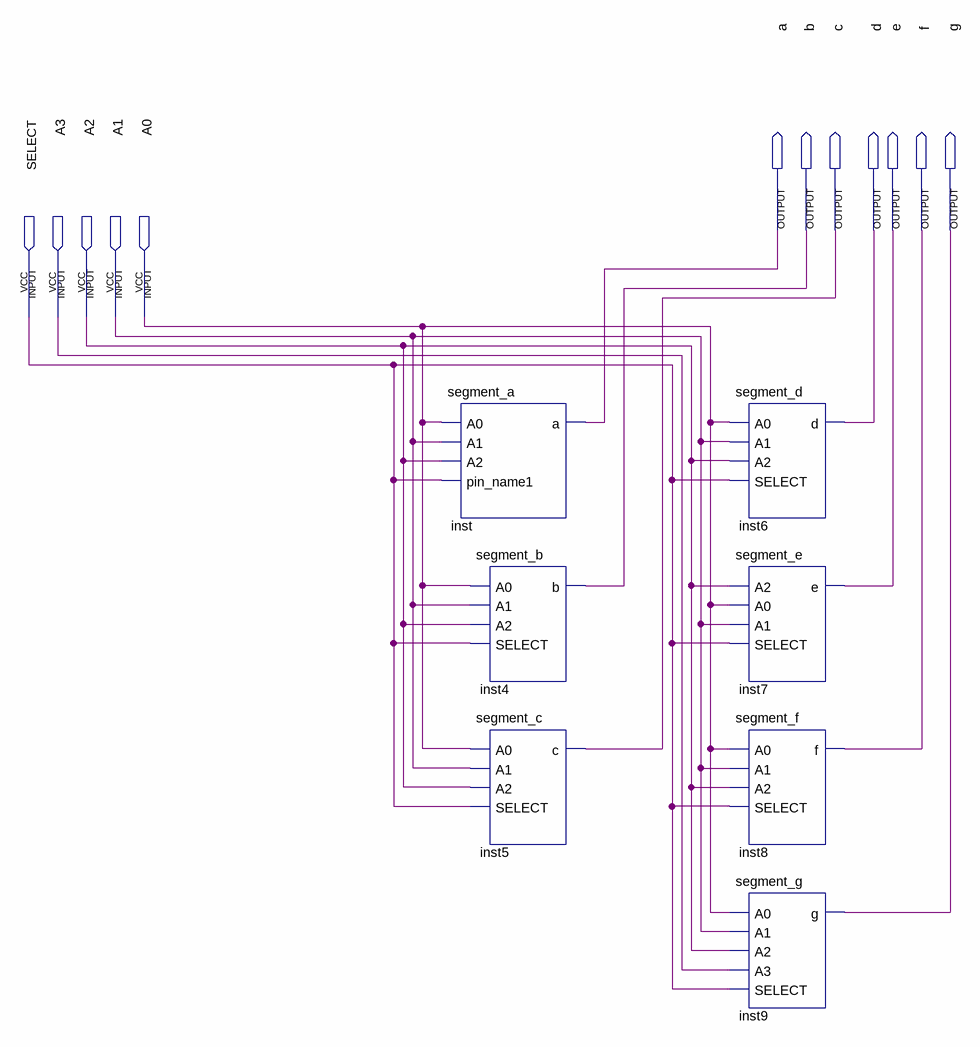
[diagram p0: schematic sheet]
// Quartus schematic segment_display_decoder.bdf as structural Verilog: 7 symbols, 12 pins
module segment_display_decoder (
  input  SELECT,
  input  A3,
  input  A2,
  input  A1,
  input  A0,
  output a,
  output b,
  output c,
  output d,
  output e,
  output f,
  output g
);

  segment_a inst (.A0(A0), .A1(A1), .A2(A2), .pin_name1(SELECT), .a(a));
  segment_b inst4 (.A0(A0), .A1(A1), .A2(A2), .SELECT(SELECT), .b(b));
  segment_c inst5 (.A0(A0), .A1(A1), .A2(A2), .SELECT(SELECT), .c(c));
  segment_d inst6 (.A0(A0), .A1(A1), .A2(A2), .SELECT(SELECT), .d(d));
  segment_e inst7 (.A2(A2), .A0(A0), .A1(A1), .SELECT(SELECT), .e(e));
  segment_f inst8 (.A0(A0), .A1(A1), .A2(A2), .SELECT(SELECT), .f(f));
  segment_g inst9 (.A0(A0), .A1(A1), .A2(A2), .A3(A3), .SELECT(SELECT), .g(g));
endmodule
